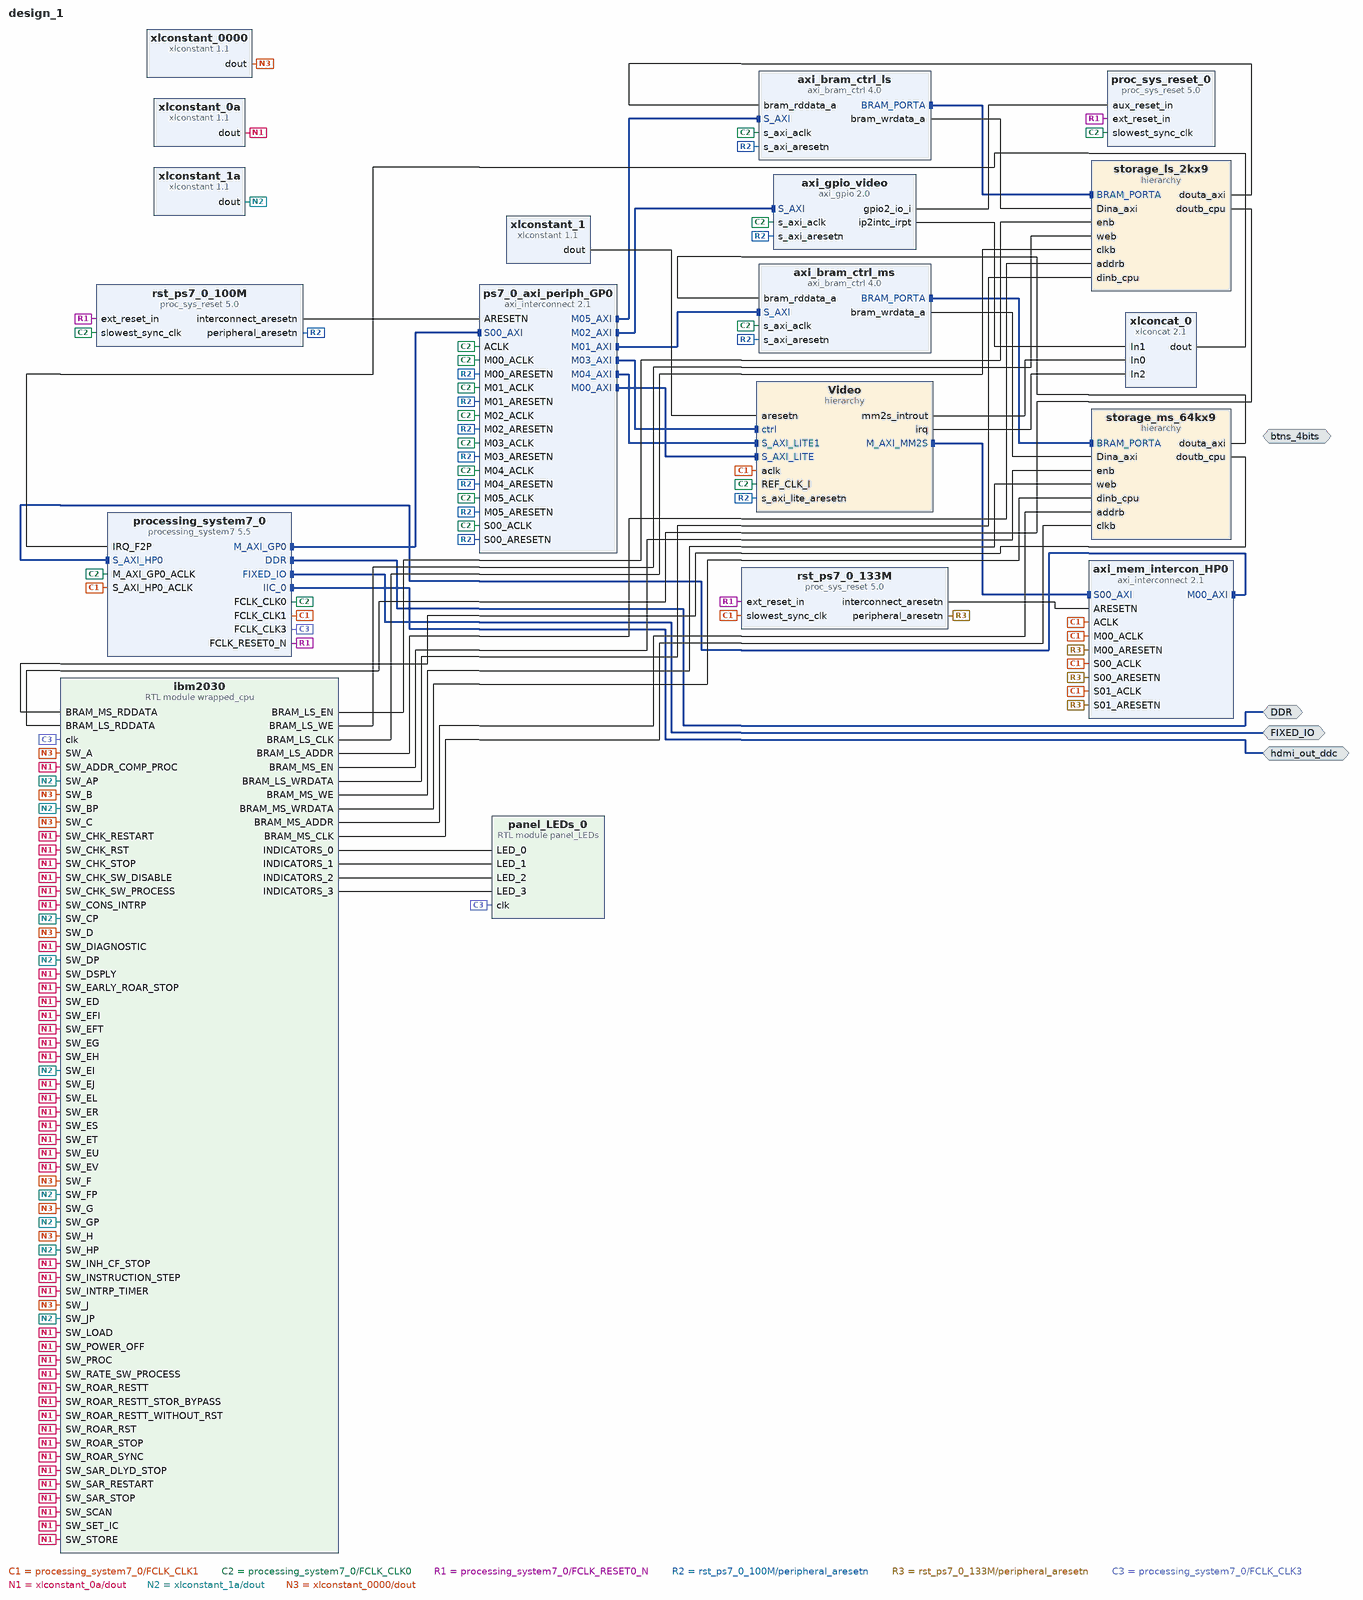
[diagram p0: block diagram of the top level]
# Vivado block design design_1, xc7z020clg400-1, Vivado 2018.2
create_bd_design design_1

create_bd_intf_port -mode Master -vlnv xilinx.com:interface:ddrx_rtl:1.0 DDR
create_bd_intf_port -mode Master -vlnv xilinx.com:display_processing_system7:fixedio_rtl:1.0 FIXED_IO
create_bd_intf_port -mode Master -vlnv xilinx.com:interface:iic_rtl:1.0 hdmi_out_ddc
create_bd_intf_port -mode Master -vlnv xilinx.com:interface:gpio_rtl:1.0 btns_4bits

create_bd_cell -type ip -vlnv xilinx.com:ip:axi_gpio:2.0 axi_gpio_video
set_property -dict [list \
  CONFIG.C_GPIO_WIDTH 4 \
  CONFIG.C_GPIO2_WIDTH 1 \
  CONFIG.C_IS_DUAL 1 \
  CONFIG.C_ALL_INPUTS 1 \
  CONFIG.C_ALL_INPUTS_2 1 \
  CONFIG.C_INTERRUPT_PRESENT 1 \
  CONFIG.USE_BOARD_FLOW true \
  CONFIG.GPIO_BOARD_INTERFACE Custom \
] [get_bd_cells axi_gpio_video]
create_bd_cell -type ip -vlnv xilinx.com:ip:axi_interconnect:2.1 axi_mem_intercon_HP0
set_property -dict {CONFIG.NUM_SI 2 CONFIG.NUM_MI 1} [get_bd_cells axi_mem_intercon_HP0]
create_bd_cell -type ip -vlnv xilinx.com:ip:proc_sys_reset:5.0 proc_sys_reset_0
create_bd_cell -type ip -vlnv xilinx.com:ip:processing_system7:5.5 processing_system7_0
set_property -dict [list \
  CONFIG.PCW_FCLK_CLK1_BUF TRUE \
  CONFIG.PCW_FCLK_CLK2_BUF TRUE \
  CONFIG.PCW_FCLK_CLK3_BUF TRUE \
  CONFIG.PCW_UIPARAM_DDR_FREQ_MHZ 533.333333 \
  CONFIG.PCW_APU_PERIPHERAL_FREQMHZ 667 \
  CONFIG.PCW_SDIO_PERIPHERAL_FREQMHZ 50 \
  CONFIG.PCW_UART_PERIPHERAL_FREQMHZ 100 \
  CONFIG.PCW_I2C_PERIPHERAL_FREQMHZ 111.111115 \
  CONFIG.PCW_FPGA0_PERIPHERAL_FREQMHZ 100 \
  CONFIG.PCW_FPGA1_PERIPHERAL_FREQMHZ 133 \
  CONFIG.PCW_FPGA2_PERIPHERAL_FREQMHZ 200 \
  CONFIG.PCW_USE_S_AXI_HP0 1 \
  CONFIG.PCW_USE_FABRIC_INTERRUPT 1 \
  CONFIG.PCW_EN_CLK1_PORT 1 \
  CONFIG.PCW_EN_CLK2_PORT 1 \
  CONFIG.PCW_EN_CLK3_PORT 1 \
  CONFIG.PCW_IRQ_F2P_INTR 1 \
  CONFIG.PCW_PRESET_BANK1_VOLTAGE {LVCMOS 1.8V} \
  CONFIG.PCW_UIPARAM_DDR_MEMORY_TYPE {DDR 3 (Low Voltage)} \
  CONFIG.PCW_UIPARAM_DDR_PARTNO {MT41K256M16 RE-125} \
  CONFIG.PCW_QSPI_PERIPHERAL_ENABLE 1 \
  CONFIG.PCW_QSPI_QSPI_IO {MIO 1 .. 6} \
  CONFIG.PCW_QSPI_GRP_SINGLE_SS_ENABLE 1 \
  CONFIG.PCW_QSPI_GRP_SINGLE_SS_IO {MIO 1 .. 6} \
  CONFIG.PCW_SINGLE_QSPI_DATA_MODE x4 \
  CONFIG.PCW_QSPI_GRP_FBCLK_ENABLE 1 \
  CONFIG.PCW_QSPI_GRP_FBCLK_IO {MIO 8} \
  CONFIG.PCW_ENET0_PERIPHERAL_ENABLE 1 \
  CONFIG.PCW_ENET0_ENET0_IO {MIO 16 .. 27} \
  CONFIG.PCW_ENET0_GRP_MDIO_ENABLE 1 \
  CONFIG.PCW_ENET0_GRP_MDIO_IO {MIO 52 .. 53} \
  CONFIG.PCW_ENET_RESET_ENABLE 1 \
  CONFIG.PCW_ENET_RESET_SELECT {Share reset pin} \
  CONFIG.PCW_ENET0_RESET_ENABLE 0 \
  CONFIG.PCW_SD0_PERIPHERAL_ENABLE 1 \
  CONFIG.PCW_SD0_SD0_IO {MIO 40 .. 45} \
  CONFIG.PCW_SD0_GRP_CD_ENABLE 1 \
  CONFIG.PCW_SD0_GRP_CD_IO {MIO 47} \
  CONFIG.PCW_SD0_GRP_WP_ENABLE 0 \
  CONFIG.PCW_UART1_PERIPHERAL_ENABLE 1 \
  CONFIG.PCW_UART1_UART1_IO {MIO 48 .. 49} \
  CONFIG.PCW_USB0_PERIPHERAL_ENABLE 1 \
  CONFIG.PCW_USB0_USB0_IO {MIO 28 .. 39} \
  CONFIG.PCW_USB_RESET_ENABLE 1 \
  CONFIG.PCW_USB_RESET_SELECT {Share reset pin} \
  CONFIG.PCW_USB0_RESET_ENABLE 1 \
  CONFIG.PCW_USB0_RESET_IO {MIO 46} \
  CONFIG.PCW_I2C0_PERIPHERAL_ENABLE 1 \
  CONFIG.PCW_I2C0_I2C0_IO EMIO \
  CONFIG.PCW_I2C_RESET_ENABLE 1 \
  CONFIG.PCW_I2C_RESET_SELECT {Share reset pin} \
  CONFIG.PCW_GPIO_MIO_GPIO_ENABLE 1 \
  CONFIG.PCW_GPIO_MIO_GPIO_IO MIO \
  CONFIG.PCW_FCLK1_PERIPHERAL_CLKSRC {DDR PLL} \
  CONFIG.PCW_FPGA_FCLK1_ENABLE 1 \
  CONFIG.PCW_FPGA_FCLK2_ENABLE 1 \
  CONFIG.PCW_FPGA_FCLK3_ENABLE 1 \
] [get_bd_cells processing_system7_0]
# 298 more settings of processing_system7_0 are not shown: defaults, MIO pin electricals, DDR timing, and values the tool derives
create_bd_cell -type ip -vlnv xilinx.com:ip:axi_interconnect:2.1 ps7_0_axi_periph_GP0
set_property -dict {CONFIG.NUM_MI 6 CONFIG.ENABLE_ADVANCED_OPTIONS 0} [get_bd_cells ps7_0_axi_periph_GP0]
create_bd_cell -type ip -vlnv xilinx.com:ip:proc_sys_reset:5.0 rst_ps7_0_100M
create_bd_cell -type ip -vlnv xilinx.com:ip:proc_sys_reset:5.0 rst_ps7_0_133M
create_bd_cell -type ip -vlnv xilinx.com:ip:xlconcat:2.1 xlconcat_0
set_property -dict {CONFIG.NUM_PORTS 3} [get_bd_cells xlconcat_0]
create_bd_cell -type ip -vlnv xilinx.com:ip:xlconstant:1.1 xlconstant_1
create_bd_cell -type ip -vlnv xilinx.com:ip:axi_bram_ctrl:4.0 axi_bram_ctrl_ms
set_property -dict [list \
  CONFIG.DATA_WIDTH 32 \
  CONFIG.PROTOCOL AXI4 \
  CONFIG.SUPPORTS_NARROW_BURST 1 \
  CONFIG.SINGLE_PORT_BRAM 1 \
] [get_bd_cells axi_bram_ctrl_ms]
create_bd_cell -type ip -vlnv xilinx.com:ip:axi_bram_ctrl:4.0 axi_bram_ctrl_ls
set_property -dict [list \
  CONFIG.DATA_WIDTH 32 \
  CONFIG.PROTOCOL AXI4 \
  CONFIG.SUPPORTS_NARROW_BURST 1 \
  CONFIG.SINGLE_PORT_BRAM 1 \
] [get_bd_cells axi_bram_ctrl_ls]
create_bd_cell -type hier storage_ms_64kx9
create_bd_cell -type hier storage_ls_2kx9
create_bd_cell -type hier Video
create_bd_cell -type module -reference panel_LEDs panel_LEDs_0
set_property -dict {CONFIG.Device MAX6951} [get_bd_cells panel_LEDs_0]
create_bd_cell -type module -reference wrapped_cpu ibm2030
create_bd_cell -type ip -vlnv xilinx.com:ip:xlconstant:1.1 xlconstant_0a
set_property -dict {CONFIG.CONST_VAL 0} [get_bd_cells xlconstant_0a]
create_bd_cell -type ip -vlnv xilinx.com:ip:xlconstant:1.1 xlconstant_1a
create_bd_cell -type ip -vlnv xilinx.com:ip:xlconstant:1.1 xlconstant_0000
set_property -dict {CONFIG.CONST_WIDTH 4 CONFIG.CONST_VAL 0000} [get_bd_cells xlconstant_0000]

# ---- hierarchy /storage_ms_64kx9 ----
current_bd_instance /storage_ms_64kx9
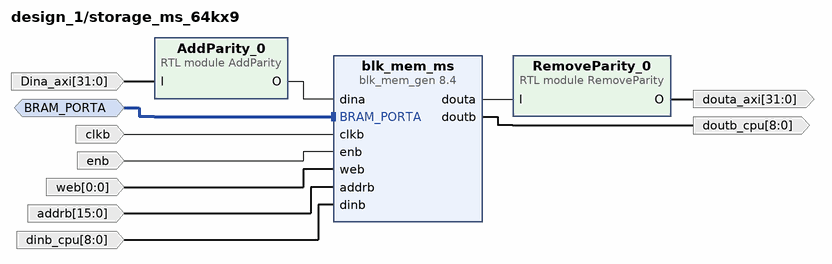
[diagram p1: block diagram inside /storage_ms_64kx9]
create_bd_intf_pin -mode Slave -vlnv xilinx.com:interface:bram_rtl:1.0 BRAM_PORTA
create_bd_pin -dir I -from 31 -to 0 Dina_axi
create_bd_pin -dir I -type clk clkb
create_bd_pin -dir I enb
create_bd_pin -dir I -from 0 -to 0 web
create_bd_pin -dir I -from 15 -to 0 addrb
create_bd_pin -dir I -from 8 -to 0 dinb_cpu
create_bd_pin -dir O -from 8 -to 0 doutb_cpu
create_bd_pin -dir O -from 31 -to 0 douta_axi

create_bd_cell -type ip -vlnv xilinx.com:ip:blk_mem_gen:8.4 blk_mem_ms
set_property -dict [list \
  CONFIG.Memory_Type True_Dual_Port_RAM \
  CONFIG.Enable_32bit_Address false \
  CONFIG.Use_Byte_Write_Enable true \
  CONFIG.Byte_Size 9 \
  CONFIG.Assume_Synchronous_Clk false \
  CONFIG.Write_Width_A 36 \
  CONFIG.Write_Depth_A 16384 \
  CONFIG.Read_Width_A 36 \
  CONFIG.Write_Width_B 9 \
  CONFIG.Read_Width_B 9 \
  CONFIG.Enable_B Use_ENB_Pin \
  CONFIG.Register_PortA_Output_of_Memory_Primitives false \
  CONFIG.Register_PortB_Output_of_Memory_Primitives false \
  CONFIG.Use_RSTA_Pin false \
  CONFIG.Use_RSTB_Pin false \
  CONFIG.Port_A_Write_Rate 50 \
  CONFIG.Port_B_Clock 100 \
  CONFIG.Port_B_Write_Rate 50 \
  CONFIG.Port_B_Enable_Rate 100 \
  CONFIG.use_bram_block Stand_Alone \
] [get_bd_cells blk_mem_ms]
create_bd_cell -type module -reference AddParity AddParity_0
create_bd_cell -type module -reference RemoveParity RemoveParity_0

# ---- hierarchy /storage_ls_2kx9 ----
current_bd_instance /storage_ls_2kx9
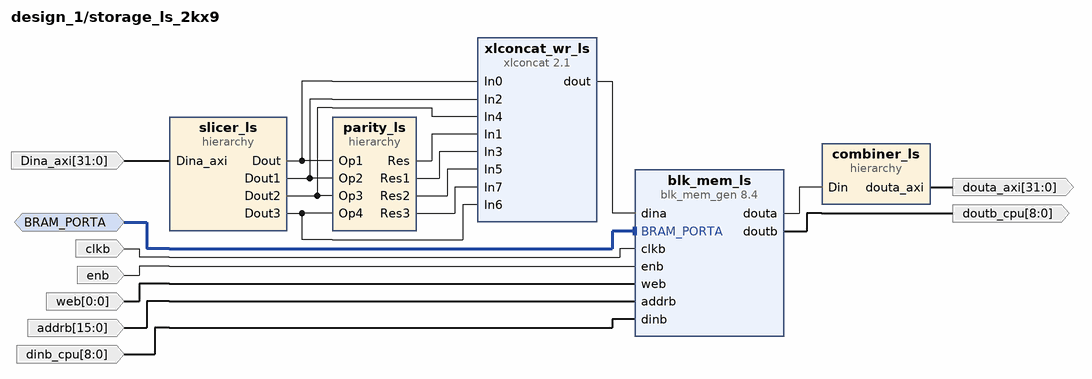
[diagram p2: block diagram inside /storage_ls_2kx9]
create_bd_intf_pin -mode Slave -vlnv xilinx.com:interface:bram_rtl:1.0 BRAM_PORTA
create_bd_pin -dir I -from 31 -to 0 Dina_axi
create_bd_pin -dir I -type clk clkb
create_bd_pin -dir I enb
create_bd_pin -dir I -from 0 -to 0 web
create_bd_pin -dir I -from 15 -to 0 addrb
create_bd_pin -dir I -from 8 -to 0 dinb_cpu
create_bd_pin -dir O -from 8 -to 0 doutb_cpu
create_bd_pin -dir O -from 31 -to 0 douta_axi

create_bd_cell -type ip -vlnv xilinx.com:ip:blk_mem_gen:8.4 blk_mem_ls
set_property -dict [list \
  CONFIG.Memory_Type True_Dual_Port_RAM \
  CONFIG.Enable_32bit_Address false \
  CONFIG.Use_Byte_Write_Enable true \
  CONFIG.Byte_Size 9 \
  CONFIG.Assume_Synchronous_Clk false \
  CONFIG.Write_Width_A 36 \
  CONFIG.Write_Depth_A 16384 \
  CONFIG.Read_Width_A 36 \
  CONFIG.Write_Width_B 9 \
  CONFIG.Read_Width_B 9 \
  CONFIG.Enable_B Use_ENB_Pin \
  CONFIG.Register_PortA_Output_of_Memory_Primitives false \
  CONFIG.Register_PortB_Output_of_Memory_Primitives false \
  CONFIG.Use_RSTA_Pin false \
  CONFIG.Use_RSTB_Pin false \
  CONFIG.Port_A_Write_Rate 50 \
  CONFIG.Port_B_Clock 100 \
  CONFIG.Port_B_Write_Rate 50 \
  CONFIG.Port_B_Enable_Rate 100 \
  CONFIG.use_bram_block Stand_Alone \
] [get_bd_cells blk_mem_ls]
create_bd_cell -type hier parity_ls
create_bd_cell -type hier slicer_ls
create_bd_cell -type ip -vlnv xilinx.com:ip:xlconcat:2.1 xlconcat_wr_ls
set_property -dict [list \
  CONFIG.NUM_PORTS 8 \
  CONFIG.IN0_WIDTH 8 \
  CONFIG.IN1_WIDTH 1 \
  CONFIG.IN2_WIDTH 8 \
  CONFIG.IN3_WIDTH 1 \
  CONFIG.IN4_WIDTH 8 \
  CONFIG.IN5_WIDTH 1 \
  CONFIG.IN6_WIDTH 8 \
  CONFIG.IN7_WIDTH 1 \
] [get_bd_cells xlconcat_wr_ls]
create_bd_cell -type hier combiner_ls

# ---- hierarchy /storage_ls_2kx9/parity_ls ----
current_bd_instance /storage_ls_2kx9/parity_ls
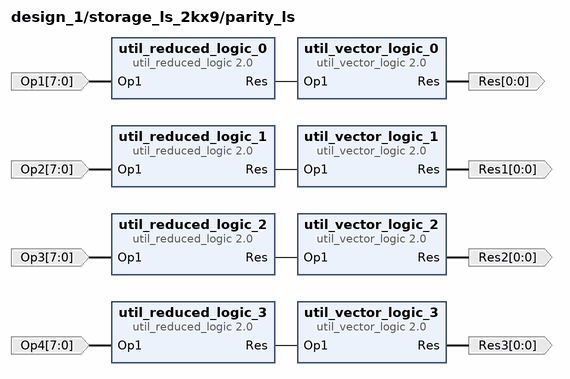
[diagram p3: block diagram inside /storage_ls_2kx9/parity_ls]
create_bd_pin -dir O -from 0 -to 0 Res
create_bd_pin -dir O -from 0 -to 0 Res1
create_bd_pin -dir O -from 0 -to 0 Res2
create_bd_pin -dir I -from 7 -to 0 Op1
create_bd_pin -dir I -from 7 -to 0 Op2
create_bd_pin -dir I -from 7 -to 0 Op3
create_bd_pin -dir I -from 7 -to 0 Op4
create_bd_pin -dir O -from 0 -to 0 Res3

create_bd_cell -type ip -vlnv xilinx.com:ip:util_vector_logic:2.0 util_vector_logic_0
set_property -dict {CONFIG.C_SIZE 1 CONFIG.C_OPERATION not} [get_bd_cells util_vector_logic_0]
create_bd_cell -type ip -vlnv xilinx.com:ip:util_vector_logic:2.0 util_vector_logic_1
set_property -dict {CONFIG.C_SIZE 1 CONFIG.C_OPERATION not} [get_bd_cells util_vector_logic_1]
create_bd_cell -type ip -vlnv xilinx.com:ip:util_vector_logic:2.0 util_vector_logic_2
set_property -dict {CONFIG.C_SIZE 1 CONFIG.C_OPERATION not} [get_bd_cells util_vector_logic_2]
create_bd_cell -type ip -vlnv xilinx.com:ip:util_reduced_logic:2.0 util_reduced_logic_0
set_property -dict {CONFIG.C_OPERATION xor} [get_bd_cells util_reduced_logic_0]
create_bd_cell -type ip -vlnv xilinx.com:ip:util_reduced_logic:2.0 util_reduced_logic_1
set_property -dict {CONFIG.C_OPERATION xor} [get_bd_cells util_reduced_logic_1]
create_bd_cell -type ip -vlnv xilinx.com:ip:util_reduced_logic:2.0 util_reduced_logic_2
set_property -dict {CONFIG.C_OPERATION xor} [get_bd_cells util_reduced_logic_2]
create_bd_cell -type ip -vlnv xilinx.com:ip:util_reduced_logic:2.0 util_reduced_logic_3
set_property -dict {CONFIG.C_OPERATION xor} [get_bd_cells util_reduced_logic_3]
create_bd_cell -type ip -vlnv xilinx.com:ip:util_vector_logic:2.0 util_vector_logic_3
set_property -dict {CONFIG.C_SIZE 1 CONFIG.C_OPERATION not} [get_bd_cells util_vector_logic_3]

# ---- hierarchy /storage_ls_2kx9/slicer_ls ----
current_bd_instance /storage_ls_2kx9/slicer_ls
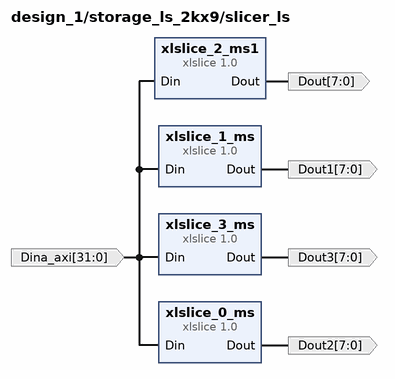
[diagram p4: block diagram inside /storage_ls_2kx9/slicer_ls]
create_bd_pin -dir I -from 31 -to 0 Dina_axi
create_bd_pin -dir O -from 7 -to 0 Dout
create_bd_pin -dir O -from 7 -to 0 Dout1
create_bd_pin -dir O -from 7 -to 0 Dout2
create_bd_pin -dir O -from 7 -to 0 Dout3

create_bd_cell -type ip -vlnv xilinx.com:ip:xlslice:1.0 xlslice_2_ms1
set_property -dict {CONFIG.DIN_TO 16 CONFIG.DIN_FROM 23 CONFIG.DIN_WIDTH 32 CONFIG.DOUT_WIDTH 8} [get_bd_cells xlslice_2_ms1]
create_bd_cell -type ip -vlnv xilinx.com:ip:xlslice:1.0 xlslice_1_ms
set_property -dict {CONFIG.DIN_TO 8 CONFIG.DIN_FROM 15 CONFIG.DIN_WIDTH 32 CONFIG.DOUT_WIDTH 8} [get_bd_cells xlslice_1_ms]
create_bd_cell -type ip -vlnv xilinx.com:ip:xlslice:1.0 xlslice_0_ms
set_property -dict {CONFIG.DIN_TO 0 CONFIG.DIN_FROM 7 CONFIG.DIN_WIDTH 32 CONFIG.DOUT_WIDTH 8} [get_bd_cells xlslice_0_ms]
create_bd_cell -type ip -vlnv xilinx.com:ip:xlslice:1.0 xlslice_3_ms
set_property -dict {CONFIG.DIN_TO 24 CONFIG.DIN_FROM 31 CONFIG.DIN_WIDTH 32 CONFIG.DOUT_WIDTH 8} [get_bd_cells xlslice_3_ms]

# ---- hierarchy /storage_ls_2kx9/combiner_ls ----
current_bd_instance /storage_ls_2kx9/combiner_ls
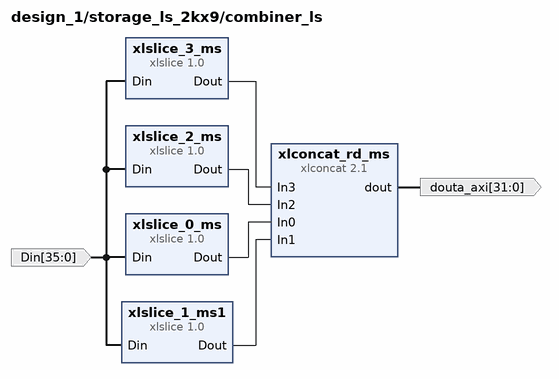
[diagram p5: block diagram inside /storage_ls_2kx9/combiner_ls]
create_bd_pin -dir I -from 35 -to 0 Din
create_bd_pin -dir O -from 31 -to 0 douta_axi

create_bd_cell -type ip -vlnv xilinx.com:ip:xlslice:1.0 xlslice_3_ms
set_property -dict {CONFIG.DIN_TO 27 CONFIG.DIN_FROM 34 CONFIG.DIN_WIDTH 36 CONFIG.DOUT_WIDTH 1} [get_bd_cells xlslice_3_ms]
create_bd_cell -type ip -vlnv xilinx.com:ip:xlslice:1.0 xlslice_0_ms
set_property -dict {CONFIG.DIN_TO 0 CONFIG.DIN_FROM 7 CONFIG.DIN_WIDTH 36 CONFIG.DOUT_WIDTH 8} [get_bd_cells xlslice_0_ms]
create_bd_cell -type ip -vlnv xilinx.com:ip:xlslice:1.0 xlslice_2_ms
set_property -dict {CONFIG.DIN_TO 18 CONFIG.DIN_FROM 25 CONFIG.DIN_WIDTH 36 CONFIG.DOUT_WIDTH 8} [get_bd_cells xlslice_2_ms]
create_bd_cell -type ip -vlnv xilinx.com:ip:xlslice:1.0 xlslice_1_ms1
set_property -dict {CONFIG.DIN_TO 9 CONFIG.DIN_FROM 16 CONFIG.DIN_WIDTH 36 CONFIG.DOUT_WIDTH 8} [get_bd_cells xlslice_1_ms1]
create_bd_cell -type ip -vlnv xilinx.com:ip:xlconcat:2.1 xlconcat_rd_ms
set_property -dict [list \
  CONFIG.NUM_PORTS 4 \
  CONFIG.IN0_WIDTH 8 \
  CONFIG.IN1_WIDTH 8 \
  CONFIG.IN2_WIDTH 8 \
  CONFIG.IN3_WIDTH 8 \
] [get_bd_cells xlconcat_rd_ms]

# ---- hierarchy /Video ----
current_bd_instance /Video
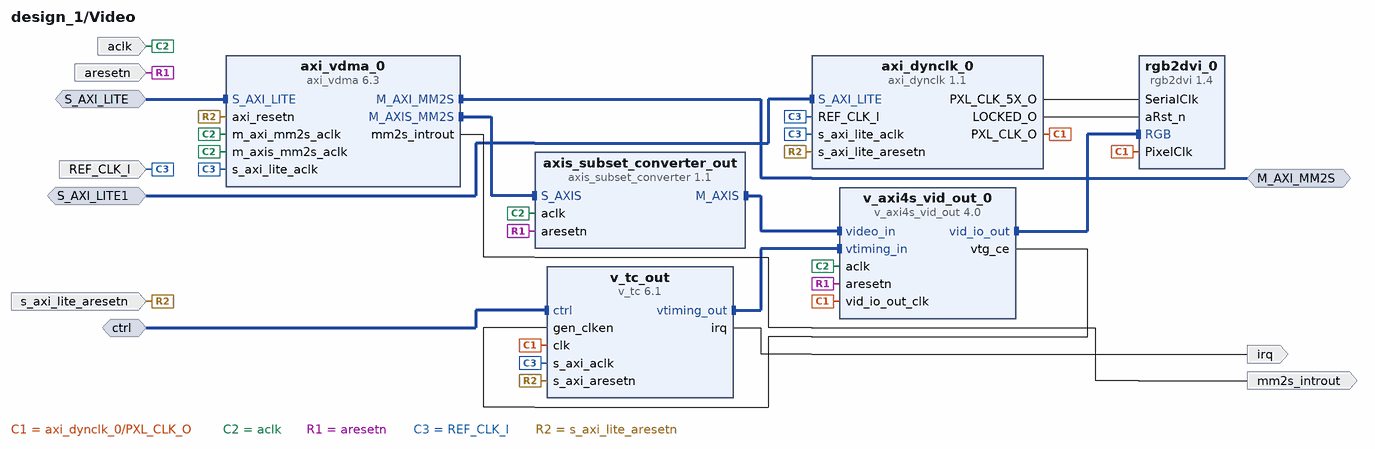
[diagram p6: block diagram inside /Video]
create_bd_intf_pin -mode Slave -vlnv xilinx.com:interface:aximm_rtl:1.0 S_AXI_LITE
create_bd_intf_pin -mode Master -vlnv xilinx.com:interface:aximm_rtl:1.0 M_AXI_MM2S
create_bd_intf_pin -mode Slave -vlnv xilinx.com:interface:aximm_rtl:1.0 S_AXI_LITE1
create_bd_intf_pin -mode Slave -vlnv xilinx.com:interface:aximm_rtl:1.0 ctrl
create_bd_pin -dir I -type clk aclk
create_bd_pin -dir I -type rst aresetn
create_bd_pin -dir I -type clk REF_CLK_I
create_bd_pin -dir I -type rst s_axi_lite_aresetn
create_bd_pin -dir O -type intr mm2s_introut
create_bd_pin -dir O -type intr irq

create_bd_cell -type ip -vlnv xilinx.com:ip:axis_subset_converter:1.1 axis_subset_converter_out
set_property -dict [list \
  CONFIG.S_TDATA_NUM_BYTES 3 \
  CONFIG.M_TDATA_NUM_BYTES 3 \
  CONFIG.S_TUSER_WIDTH 1 \
  CONFIG.M_TUSER_WIDTH 1 \
  CONFIG.S_HAS_TKEEP 1 \
  CONFIG.S_HAS_TLAST 1 \
  CONFIG.M_HAS_TKEEP 1 \
  CONFIG.M_HAS_TLAST 1 \
  CONFIG.TDATA_REMAP {tdata[23:16],tdata[7:0],tdata[15:8]} \
  CONFIG.TUSER_REMAP {tuser[0:0]} \
  CONFIG.TKEEP_REMAP {tkeep[2:0]} \
  CONFIG.TLAST_REMAP {tlast[0]} \
] [get_bd_cells axis_subset_converter_out]
create_bd_cell -type ip -vlnv xilinx.com:ip:axi_vdma:6.3 axi_vdma_0
set_property -dict [list \
  CONFIG.c_m_axis_mm2s_tdata_width 24 \
  CONFIG.c_mm2s_linebuffer_depth 2048 \
  CONFIG.c_include_s2mm 0 \
] [get_bd_cells axi_vdma_0]
create_bd_cell -type ip -vlnv digilentinc.com:ip:axi_dynclk:1.1 axi_dynclk_0
create_bd_cell -type ip -vlnv digilentinc.com:ip:rgb2dvi:1.4 rgb2dvi_0
set_property -dict [list \
  CONFIG.kRstActiveHigh false \
  CONFIG.kGenerateSerialClk false \
  CONFIG.TMDS_BOARD_INTERFACE hdmi_out \
] [get_bd_cells rgb2dvi_0]
create_bd_cell -type ip -vlnv xilinx.com:ip:v_axi4s_vid_out:4.0 v_axi4s_vid_out_0
set_property -dict {CONFIG.C_HAS_ASYNC_CLK 1 CONFIG.C_ADDR_WIDTH 12 CONFIG.C_VTG_MASTER_SLAVE 1} [get_bd_cells v_axi4s_vid_out_0]
create_bd_cell -type ip -vlnv xilinx.com:ip:v_tc:6.1 v_tc_out
set_property -dict {CONFIG.VIDEO_MODE 640x480p CONFIG.enable_detection false} [get_bd_cells v_tc_out]

# ---- connections ----

current_bd_instance /storage_ms_64kx9
connect_bd_intf_net -intf_net axi_bram_ctrl_ms_BRAM_PORTA [get_bd_intf_pins BRAM_PORTA] [get_bd_intf_pins blk_mem_ms/BRAM_PORTA]
connect_bd_net -net wrapped_cpu_0_BRAM_MS_CLK [get_bd_pins clkb] [get_bd_pins blk_mem_ms/clkb]
connect_bd_net -net wrapped_cpu_0_BRAM_MS_EN [get_bd_pins enb] [get_bd_pins blk_mem_ms/enb]
connect_bd_net -net wrapped_cpu_0_BRAM_MS_WE [get_bd_pins web] [get_bd_pins blk_mem_ms/web]
connect_bd_net -net wrapped_cpu_0_BRAM_MS_ADDR [get_bd_pins addrb] [get_bd_pins blk_mem_ms/addrb]
connect_bd_net -net wrapped_cpu_0_BRAM_MS_WRDATA [get_bd_pins dinb_cpu] [get_bd_pins blk_mem_ms/dinb]
connect_bd_net -net blk_mem_gen_0_doutb [get_bd_pins blk_mem_ms/doutb] [get_bd_pins doutb_cpu]
connect_bd_net [get_bd_pins Dina_axi] [get_bd_pins AddParity_0/I]
connect_bd_net [get_bd_pins AddParity_0/O] [get_bd_pins blk_mem_ms/dina]
connect_bd_net [get_bd_pins RemoveParity_0/O] [get_bd_pins douta_axi]
connect_bd_net [get_bd_pins blk_mem_ms/douta] [get_bd_pins RemoveParity_0/I]

current_bd_instance /storage_ls_2kx9
connect_bd_intf_net -intf_net axi_bram_ctrl_ls_BRAM_PORTA [get_bd_intf_pins BRAM_PORTA] [get_bd_intf_pins blk_mem_ls/BRAM_PORTA]
connect_bd_net -net wrapped_cpu_0_BRAM_LS_CLK [get_bd_pins clkb] [get_bd_pins blk_mem_ls/clkb]
connect_bd_net -net wrapped_cpu_0_BRAM_LS_EN [get_bd_pins enb] [get_bd_pins blk_mem_ls/enb]
connect_bd_net -net wrapped_cpu_0_BRAM_LS_WE [get_bd_pins web] [get_bd_pins blk_mem_ls/web]
connect_bd_net -net wrapped_cpu_0_BRAM_LS_ADDR [get_bd_pins addrb] [get_bd_pins blk_mem_ls/addrb]
connect_bd_net -net wrapped_cpu_0_BRAM_MS_CLK [get_bd_pins dinb_cpu] [get_bd_pins blk_mem_ls/dinb]
connect_bd_net [get_bd_pins blk_mem_ls/doutb] [get_bd_pins doutb_cpu]
connect_bd_net [get_bd_pins Dina_axi] [get_bd_pins slicer_ls/Dina_axi]
connect_bd_net [get_bd_pins slicer_ls/Dout] [get_bd_pins xlconcat_wr_ls/In0] [get_bd_pins parity_ls/Op1]
connect_bd_net [get_bd_pins slicer_ls/Dout1] [get_bd_pins xlconcat_wr_ls/In2] [get_bd_pins parity_ls/Op2]
connect_bd_net [get_bd_pins slicer_ls/Dout2] [get_bd_pins xlconcat_wr_ls/In4] [get_bd_pins parity_ls/Op3]
connect_bd_net [get_bd_pins slicer_ls/Dout3] [get_bd_pins xlconcat_wr_ls/In6] [get_bd_pins parity_ls/Op4]
connect_bd_net [get_bd_pins parity_ls/Res] [get_bd_pins xlconcat_wr_ls/In1]
connect_bd_net [get_bd_pins parity_ls/Res1] [get_bd_pins xlconcat_wr_ls/In3]
connect_bd_net [get_bd_pins parity_ls/Res2] [get_bd_pins xlconcat_wr_ls/In5]
connect_bd_net [get_bd_pins parity_ls/Res3] [get_bd_pins xlconcat_wr_ls/In7]
connect_bd_net [get_bd_pins xlconcat_wr_ls/dout] [get_bd_pins blk_mem_ls/dina]
connect_bd_net [get_bd_pins combiner_ls/douta_axi] [get_bd_pins douta_axi]
connect_bd_net [get_bd_pins blk_mem_ls/douta] [get_bd_pins combiner_ls/Din]

current_bd_instance /storage_ls_2kx9/parity_ls
connect_bd_net [get_bd_pins util_reduced_logic_0/Res] [get_bd_pins util_vector_logic_0/Op1]
connect_bd_net [get_bd_pins util_reduced_logic_1/Res] [get_bd_pins util_vector_logic_1/Op1]
connect_bd_net [get_bd_pins util_reduced_logic_2/Res] [get_bd_pins util_vector_logic_2/Op1]
connect_bd_net [get_bd_pins util_reduced_logic_3/Res] [get_bd_pins util_vector_logic_3/Op1]
connect_bd_net [get_bd_pins util_vector_logic_0/Res] [get_bd_pins Res]
connect_bd_net [get_bd_pins util_vector_logic_1/Res] [get_bd_pins Res1]
connect_bd_net [get_bd_pins util_vector_logic_2/Res] [get_bd_pins Res2]
connect_bd_net -net xlslice_0_ms_Dout [get_bd_pins Op1] [get_bd_pins util_reduced_logic_0/Op1]
connect_bd_net -net xlslice_1_ms_Dout [get_bd_pins Op2] [get_bd_pins util_reduced_logic_1/Op1]
connect_bd_net -net xlslice_2_ms1_Dout [get_bd_pins Op3] [get_bd_pins util_reduced_logic_2/Op1]
connect_bd_net -net xlslice_3_ms_Dout [get_bd_pins Op4] [get_bd_pins util_reduced_logic_3/Op1]
connect_bd_net [get_bd_pins util_vector_logic_3/Res] [get_bd_pins Res3]

current_bd_instance /storage_ls_2kx9/slicer_ls
connect_bd_net -net axi_bram_ctrl_ms_bram_wrdata_a [get_bd_pins Dina_axi] \
  [get_bd_pins xlslice_0_ms/Din] [get_bd_pins xlslice_3_ms/Din] [get_bd_pins xlslice_1_ms/Din] \
  [get_bd_pins xlslice_2_ms1/Din]
connect_bd_net [get_bd_pins xlslice_2_ms1/Dout] [get_bd_pins Dout]
connect_bd_net [get_bd_pins xlslice_1_ms/Dout] [get_bd_pins Dout1]
connect_bd_net [get_bd_pins xlslice_0_ms/Dout] [get_bd_pins Dout2]
connect_bd_net [get_bd_pins xlslice_3_ms/Dout] [get_bd_pins Dout3]

current_bd_instance /storage_ls_2kx9/combiner_ls
connect_bd_net [get_bd_pins xlslice_3_ms/Dout] [get_bd_pins xlconcat_rd_ms/In3]
connect_bd_net -net xlslice_low9_ms_Dout [get_bd_pins xlslice_0_ms/Dout] [get_bd_pins xlconcat_rd_ms/In0]
connect_bd_net [get_bd_pins xlslice_2_ms/Dout] [get_bd_pins xlconcat_rd_ms/In2]
connect_bd_net [get_bd_pins xlslice_1_ms1/Dout] [get_bd_pins xlconcat_rd_ms/In1]
connect_bd_net -net blk_mem_ms_douta [get_bd_pins Din] \
  [get_bd_pins xlslice_0_ms/Din] [get_bd_pins xlslice_1_ms1/Din] [get_bd_pins xlslice_2_ms/Din] \
  [get_bd_pins xlslice_3_ms/Din]
connect_bd_net [get_bd_pins xlconcat_rd_ms/dout] [get_bd_pins douta_axi]

current_bd_instance /Video
connect_bd_intf_net [get_bd_intf_pins axi_vdma_0/M_AXIS_MM2S] [get_bd_intf_pins axis_subset_converter_out/S_AXIS]
connect_bd_intf_net [get_bd_intf_pins axis_subset_converter_out/M_AXIS] [get_bd_intf_pins v_axi4s_vid_out_0/video_in]
connect_bd_intf_net [get_bd_intf_pins rgb2dvi_0/RGB] [get_bd_intf_pins v_axi4s_vid_out_0/vid_io_out]
connect_bd_intf_net [get_bd_intf_pins v_axi4s_vid_out_0/vtiming_in] [get_bd_intf_pins v_tc_out/vtiming_out]
connect_bd_intf_net [get_bd_intf_pins S_AXI_LITE] [get_bd_intf_pins axi_vdma_0/S_AXI_LITE]
connect_bd_intf_net [get_bd_intf_pins M_AXI_MM2S] [get_bd_intf_pins axi_vdma_0/M_AXI_MM2S]
connect_bd_intf_net [get_bd_intf_pins S_AXI_LITE1] [get_bd_intf_pins axi_dynclk_0/S_AXI_LITE]
connect_bd_intf_net [get_bd_intf_pins ctrl] [get_bd_intf_pins v_tc_out/ctrl]
connect_bd_net [get_bd_pins axi_dynclk_0/PXL_CLK_O] \
  [get_bd_pins v_tc_out/clk] [get_bd_pins v_axi4s_vid_out_0/vid_io_out_clk] [get_bd_pins rgb2dvi_0/PixelClk]
connect_bd_net [get_bd_pins axi_dynclk_0/PXL_CLK_5X_O] [get_bd_pins rgb2dvi_0/SerialClk]
connect_bd_net [get_bd_pins axi_dynclk_0/LOCKED_O] [get_bd_pins rgb2dvi_0/aRst_n]
connect_bd_net [get_bd_pins v_axi4s_vid_out_0/vtg_ce] [get_bd_pins v_tc_out/gen_clken]
connect_bd_net [get_bd_pins aclk] \
  [get_bd_pins v_axi4s_vid_out_0/aclk] [get_bd_pins axi_vdma_0/m_axis_mm2s_aclk] [get_bd_pins axi_vdma_0/m_axi_mm2s_aclk] \
  [get_bd_pins axis_subset_converter_out/aclk]
connect_bd_net -net xlconstant_0_dout [get_bd_pins aresetn] [get_bd_pins v_axi4s_vid_out_0/aresetn] [get_bd_pins axis_subset_converter_out/aresetn]
connect_bd_net -net processing_system7_0_FCLK_CLK0 [get_bd_pins REF_CLK_I] \
  [get_bd_pins axi_dynclk_0/REF_CLK_I] [get_bd_pins axi_dynclk_0/s_axi_lite_aclk] [get_bd_pins v_tc_out/s_axi_aclk] \
  [get_bd_pins axi_vdma_0/s_axi_lite_aclk]
connect_bd_net -net rst_ps7_0_100M_peripheral_aresetn [get_bd_pins s_axi_lite_aresetn] \
  [get_bd_pins axi_dynclk_0/s_axi_lite_aresetn] [get_bd_pins v_tc_out/s_axi_aresetn] [get_bd_pins axi_vdma_0/axi_resetn]
connect_bd_net [get_bd_pins axi_vdma_0/mm2s_introut] [get_bd_pins mm2s_introut]
connect_bd_net [get_bd_pins v_tc_out/irq] [get_bd_pins irq]

current_bd_instance /
connect_bd_intf_net -intf_net axi_mem_intercon_M00_AXI [get_bd_intf_pins axi_mem_intercon_HP0/M00_AXI] [get_bd_intf_pins processing_system7_0/S_AXI_HP0]
connect_bd_intf_net -intf_net axi_vdma_0_M_AXI_MM2S [get_bd_intf_pins axi_mem_intercon_HP0/S00_AXI] [get_bd_intf_pins Video/M_AXI_MM2S]
connect_bd_intf_net [get_bd_intf_pins processing_system7_0/M_AXI_GP0] [get_bd_intf_pins ps7_0_axi_periph_GP0/S00_AXI]
connect_bd_intf_net [get_bd_intf_pins ps7_0_axi_periph_GP0/M03_AXI] [get_bd_intf_pins Video/ctrl]
connect_bd_intf_net [get_bd_intf_pins Video/S_AXI_LITE1] [get_bd_intf_pins ps7_0_axi_periph_GP0/M04_AXI]
connect_bd_intf_net [get_bd_intf_pins Video/S_AXI_LITE] [get_bd_intf_pins ps7_0_axi_periph_GP0/M00_AXI]
connect_bd_intf_net [get_bd_intf_pins axi_gpio_video/S_AXI] [get_bd_intf_pins ps7_0_axi_periph_GP0/M02_AXI]
connect_bd_intf_net [get_bd_intf_pins ps7_0_axi_periph_GP0/M01_AXI] [get_bd_intf_pins axi_bram_ctrl_ms/S_AXI]
connect_bd_intf_net [get_bd_intf_pins axi_bram_ctrl_ls/S_AXI] [get_bd_intf_pins ps7_0_axi_periph_GP0/M05_AXI]
connect_bd_intf_net [get_bd_intf_pins axi_bram_ctrl_ms/BRAM_PORTA] [get_bd_intf_pins storage_ms_64kx9/BRAM_PORTA]
connect_bd_intf_net [get_bd_intf_pins axi_bram_ctrl_ls/BRAM_PORTA] [get_bd_intf_pins storage_ls_2kx9/BRAM_PORTA]
connect_bd_intf_net [get_bd_intf_ports DDR] [get_bd_intf_pins processing_system7_0/DDR]
connect_bd_intf_net [get_bd_intf_ports FIXED_IO] [get_bd_intf_pins processing_system7_0/FIXED_IO]
connect_bd_intf_net [get_bd_intf_ports hdmi_out_ddc] [get_bd_intf_pins processing_system7_0/IIC_0]
connect_bd_net [get_bd_pins processing_system7_0/FCLK_CLK1] \
  [get_bd_pins processing_system7_0/S_AXI_HP0_ACLK] [get_bd_pins rst_ps7_0_133M/slowest_sync_clk] \
  [get_bd_pins axi_mem_intercon_HP0/ACLK] [get_bd_pins axi_mem_intercon_HP0/M00_ACLK] \
  [get_bd_pins axi_mem_intercon_HP0/S00_ACLK] [get_bd_pins axi_mem_intercon_HP0/S01_ACLK] [get_bd_pins Video/aclk]
connect_bd_net -net axi_vdma_0_mm2s_introut [get_bd_pins Video/mm2s_introut] [get_bd_pins xlconcat_0/In0]
connect_bd_net -net dvi2rgb_0_aPixelClkLckd [get_bd_pins axi_gpio_video/gpio2_io_i] [get_bd_pins proc_sys_reset_0/aux_reset_in]
connect_bd_net [get_bd_pins processing_system7_0/FCLK_CLK0] \
  [get_bd_pins axi_gpio_video/s_axi_aclk] [get_bd_pins processing_system7_0/M_AXI_GP0_ACLK] \
  [get_bd_pins rst_ps7_0_100M/slowest_sync_clk] [get_bd_pins proc_sys_reset_0/slowest_sync_clk] \
  [get_bd_pins axi_bram_ctrl_ms/s_axi_aclk] [get_bd_pins axi_bram_ctrl_ls/s_axi_aclk] [get_bd_pins ps7_0_axi_periph_GP0/ACLK] \
  [get_bd_pins ps7_0_axi_periph_GP0/M00_ACLK] [get_bd_pins ps7_0_axi_periph_GP0/M01_ACLK] \
  [get_bd_pins ps7_0_axi_periph_GP0/M02_ACLK] [get_bd_pins ps7_0_axi_periph_GP0/M03_ACLK] \
  [get_bd_pins ps7_0_axi_periph_GP0/M04_ACLK] [get_bd_pins ps7_0_axi_periph_GP0/S00_ACLK] \
  [get_bd_pins ps7_0_axi_periph_GP0/M05_ACLK] [get_bd_pins Video/REF_CLK_I]
connect_bd_net [get_bd_pins processing_system7_0/FCLK_RESET0_N] \
  [get_bd_pins proc_sys_reset_0/ext_reset_in] [get_bd_pins rst_ps7_0_100M/ext_reset_in] \
  [get_bd_pins rst_ps7_0_133M/ext_reset_in]
connect_bd_net [get_bd_pins rst_ps7_0_100M/interconnect_aresetn] [get_bd_pins ps7_0_axi_periph_GP0/ARESETN]
connect_bd_net [get_bd_pins rst_ps7_0_100M/peripheral_aresetn] \
  [get_bd_pins axi_gpio_video/s_axi_aresetn] [get_bd_pins axi_bram_ctrl_ms/s_axi_aresetn] \
  [get_bd_pins axi_bram_ctrl_ls/s_axi_aresetn] [get_bd_pins ps7_0_axi_periph_GP0/M00_ARESETN] \
  [get_bd_pins ps7_0_axi_periph_GP0/M01_ARESETN] [get_bd_pins ps7_0_axi_periph_GP0/M02_ARESETN] \
  [get_bd_pins ps7_0_axi_periph_GP0/M03_ARESETN] [get_bd_pins ps7_0_axi_periph_GP0/M04_ARESETN] \
  [get_bd_pins ps7_0_axi_periph_GP0/S00_ARESETN] [get_bd_pins ps7_0_axi_periph_GP0/M05_ARESETN] \
  [get_bd_pins Video/s_axi_lite_aresetn]
connect_bd_net [get_bd_pins rst_ps7_0_133M/interconnect_aresetn] [get_bd_pins axi_mem_intercon_HP0/ARESETN]
connect_bd_net [get_bd_pins rst_ps7_0_133M/peripheral_aresetn] \
  [get_bd_pins axi_mem_intercon_HP0/M00_ARESETN] [get_bd_pins axi_mem_intercon_HP0/S00_ARESETN] \
  [get_bd_pins axi_mem_intercon_HP0/S01_ARESETN]
connect_bd_net [get_bd_pins xlconcat_0/dout] [get_bd_pins processing_system7_0/IRQ_F2P]
connect_bd_net -net xlconstant_0_dout [get_bd_pins xlconstant_1/dout] [get_bd_pins Video/aresetn]
connect_bd_net -net wrapped_cpu_0_BRAM_MS_EN [get_bd_pins ibm2030/BRAM_MS_EN] [get_bd_pins storage_ms_64kx9/enb]
connect_bd_net -net wrapped_cpu_0_BRAM_MS_WE [get_bd_pins ibm2030/BRAM_MS_WE] [get_bd_pins storage_ms_64kx9/web]
connect_bd_net -net wrapped_cpu_0_BRAM_MS_WRDATA [get_bd_pins ibm2030/BRAM_MS_WRDATA] [get_bd_pins storage_ms_64kx9/dinb_cpu]
connect_bd_net -net wrapped_cpu_0_BRAM_MS_ADDR [get_bd_pins ibm2030/BRAM_MS_ADDR] [get_bd_pins storage_ms_64kx9/addrb]
connect_bd_net -net blk_mem_gen_0_doutb [get_bd_pins storage_ms_64kx9/doutb_cpu] [get_bd_pins ibm2030/BRAM_MS_RDDATA]
connect_bd_net -net wrapped_cpu_0_BRAM_LS_EN [get_bd_pins ibm2030/BRAM_LS_EN] [get_bd_pins storage_ls_2kx9/enb]
connect_bd_net -net wrapped_cpu_0_BRAM_LS_WE [get_bd_pins ibm2030/BRAM_LS_WE] [get_bd_pins storage_ls_2kx9/web]
connect_bd_net -net wrapped_cpu_0_BRAM_LS_CLK [get_bd_pins ibm2030/BRAM_LS_CLK] [get_bd_pins storage_ls_2kx9/clkb]
connect_bd_net -net wrapped_cpu_0_BRAM_LS_ADDR [get_bd_pins ibm2030/BRAM_LS_ADDR] [get_bd_pins storage_ls_2kx9/addrb]
connect_bd_net [get_bd_pins axi_bram_ctrl_ms/bram_wrdata_a] [get_bd_pins storage_ms_64kx9/Dina_axi]
connect_bd_net [get_bd_pins axi_bram_ctrl_ls/bram_wrdata_a] [get_bd_pins storage_ls_2kx9/Dina_axi]
connect_bd_net -net xlconcat_rd_ms1_dout [get_bd_pins storage_ls_2kx9/douta_axi] [get_bd_pins axi_bram_ctrl_ls/bram_rddata_a]
connect_bd_net -net xlconcat_rd_ms_dout [get_bd_pins storage_ms_64kx9/douta_axi] [get_bd_pins axi_bram_ctrl_ms/bram_rddata_a]
connect_bd_net [get_bd_pins storage_ls_2kx9/doutb_cpu] [get_bd_pins ibm2030/BRAM_LS_RDDATA]
connect_bd_net [get_bd_pins ibm2030/BRAM_MS_CLK] [get_bd_pins storage_ms_64kx9/clkb]
connect_bd_net -net dinb_cpu_1 [get_bd_pins ibm2030/BRAM_LS_WRDATA] [get_bd_pins storage_ls_2kx9/dinb_cpu]
connect_bd_net [get_bd_pins axi_gpio_video/ip2intc_irpt] [get_bd_pins xlconcat_0/In1]
connect_bd_net -net v_tc_out_irq [get_bd_pins Video/irq] [get_bd_pins xlconcat_0/In2]
connect_bd_net [get_bd_pins ibm2030/INDICATORS_0] [get_bd_pins panel_LEDs_0/LED_0]
connect_bd_net [get_bd_pins ibm2030/INDICATORS_1] [get_bd_pins panel_LEDs_0/LED_1]
connect_bd_net [get_bd_pins ibm2030/INDICATORS_2] [get_bd_pins panel_LEDs_0/LED_2]
connect_bd_net [get_bd_pins ibm2030/INDICATORS_3] [get_bd_pins panel_LEDs_0/LED_3]
connect_bd_net [get_bd_pins processing_system7_0/FCLK_CLK3] [get_bd_pins panel_LEDs_0/clk] [get_bd_pins ibm2030/clk]
connect_bd_net -net xlconstant_1_dout [get_bd_pins xlconstant_0a/dout] \
  [get_bd_pins ibm2030/SW_CONS_INTRP] [get_bd_pins ibm2030/SW_DIAGNOSTIC] [get_bd_pins ibm2030/SW_CHK_STOP] \
  [get_bd_pins ibm2030/SW_CHK_SW_PROCESS] [get_bd_pins ibm2030/SW_CHK_SW_DISABLE] \
  [get_bd_pins ibm2030/SW_ROAR_RESTT_STOR_BYPASS] [get_bd_pins ibm2030/SW_ROAR_RESTT] \
  [get_bd_pins ibm2030/SW_EARLY_ROAR_STOP] [get_bd_pins ibm2030/SW_ROAR_RESTT_WITHOUT_RST] \
  [get_bd_pins ibm2030/SW_CHK_RESTART] [get_bd_pins ibm2030/SW_ROAR_RST] [get_bd_pins ibm2030/SW_CHK_RST] \
  [get_bd_pins ibm2030/SW_STORE] [get_bd_pins ibm2030/SW_DSPLY] [get_bd_pins ibm2030/SW_RATE_SW_PROCESS] \
  [get_bd_pins ibm2030/SW_INSTRUCTION_STEP] [get_bd_pins ibm2030/SW_SCAN] [get_bd_pins ibm2030/SW_PROC] \
  [get_bd_pins ibm2030/SW_INH_CF_STOP] [get_bd_pins ibm2030/SW_POWER_OFF] [get_bd_pins ibm2030/SW_SET_IC] \
  [get_bd_pins ibm2030/SW_LOAD] [get_bd_pins ibm2030/SW_ROAR_STOP] [get_bd_pins ibm2030/SW_ROAR_SYNC] \
  [get_bd_pins ibm2030/SW_ADDR_COMP_PROC] [get_bd_pins ibm2030/SW_SAR_DLYD_STOP] [get_bd_pins ibm2030/SW_SAR_STOP] \
  [get_bd_pins ibm2030/SW_SAR_RESTART] [get_bd_pins ibm2030/SW_INTRP_TIMER] [get_bd_pins ibm2030/SW_EJ] \
  [get_bd_pins ibm2030/SW_EU] [get_bd_pins ibm2030/SW_EV] [get_bd_pins ibm2030/SW_EL] [get_bd_pins ibm2030/SW_ET] \
  [get_bd_pins ibm2030/SW_ED] [get_bd_pins ibm2030/SW_ER] [get_bd_pins ibm2030/SW_ES] [get_bd_pins ibm2030/SW_EG] \
  [get_bd_pins ibm2030/SW_EH] [get_bd_pins ibm2030/SW_EFI] [get_bd_pins ibm2030/SW_EFT]
connect_bd_net -net xlconstant_2_dout [get_bd_pins xlconstant_1a/dout] \
  [get_bd_pins ibm2030/SW_AP] [get_bd_pins ibm2030/SW_BP] [get_bd_pins ibm2030/SW_CP] [get_bd_pins ibm2030/SW_DP] \
  [get_bd_pins ibm2030/SW_FP] [get_bd_pins ibm2030/SW_GP] [get_bd_pins ibm2030/SW_HP] [get_bd_pins ibm2030/SW_JP] \
  [get_bd_pins ibm2030/SW_EI]
connect_bd_net [get_bd_pins xlconstant_0000/dout] \
  [get_bd_pins ibm2030/SW_A] [get_bd_pins ibm2030/SW_B] [get_bd_pins ibm2030/SW_C] [get_bd_pins ibm2030/SW_D] \
  [get_bd_pins ibm2030/SW_F] [get_bd_pins ibm2030/SW_G] [get_bd_pins ibm2030/SW_H] [get_bd_pins ibm2030/SW_J]

# ---- address map ----
assign_bd_address -offset 0x40000000 -range 128K -target_address_space [get_bd_addr_spaces processing_system7_0/Data] [get_bd_addr_segs axi_bram_ctrl_ms/S_AXI/Mem0]
assign_bd_address -offset 0x41200000 -range 64K -target_address_space [get_bd_addr_spaces processing_system7_0/Data] [get_bd_addr_segs axi_gpio_video/S_AXI/Reg]
assign_bd_address -offset 0x42000000 -range 4K -target_address_space [get_bd_addr_spaces processing_system7_0/Data] [get_bd_addr_segs axi_bram_ctrl_ls/S_AXI/Mem0]
assign_bd_address -offset 0x43000000 -range 64K -target_address_space [get_bd_addr_spaces processing_system7_0/Data] [get_bd_addr_segs Video/axi_vdma_0/S_AXI_LITE/Reg]
assign_bd_address -offset 0x43C00000 -range 64K -target_address_space [get_bd_addr_spaces processing_system7_0/Data] [get_bd_addr_segs Video/axi_dynclk_0/S_AXI_LITE/S_AXI_LITE_reg]
assign_bd_address -offset 0x43C10000 -range 64K -target_address_space [get_bd_addr_spaces processing_system7_0/Data] [get_bd_addr_segs Video/v_tc_out/ctrl/Reg]
assign_bd_address -offset 0x00000000 -range 1G -target_address_space [get_bd_addr_spaces Video/axi_vdma_0/Data_MM2S] [get_bd_addr_segs processing_system7_0/S_AXI_HP0/HP0_DDR_LOWOCM]

validate_bd_design
save_bd_design
